# EAGLE design tbs4 (EAGLE 6.2)
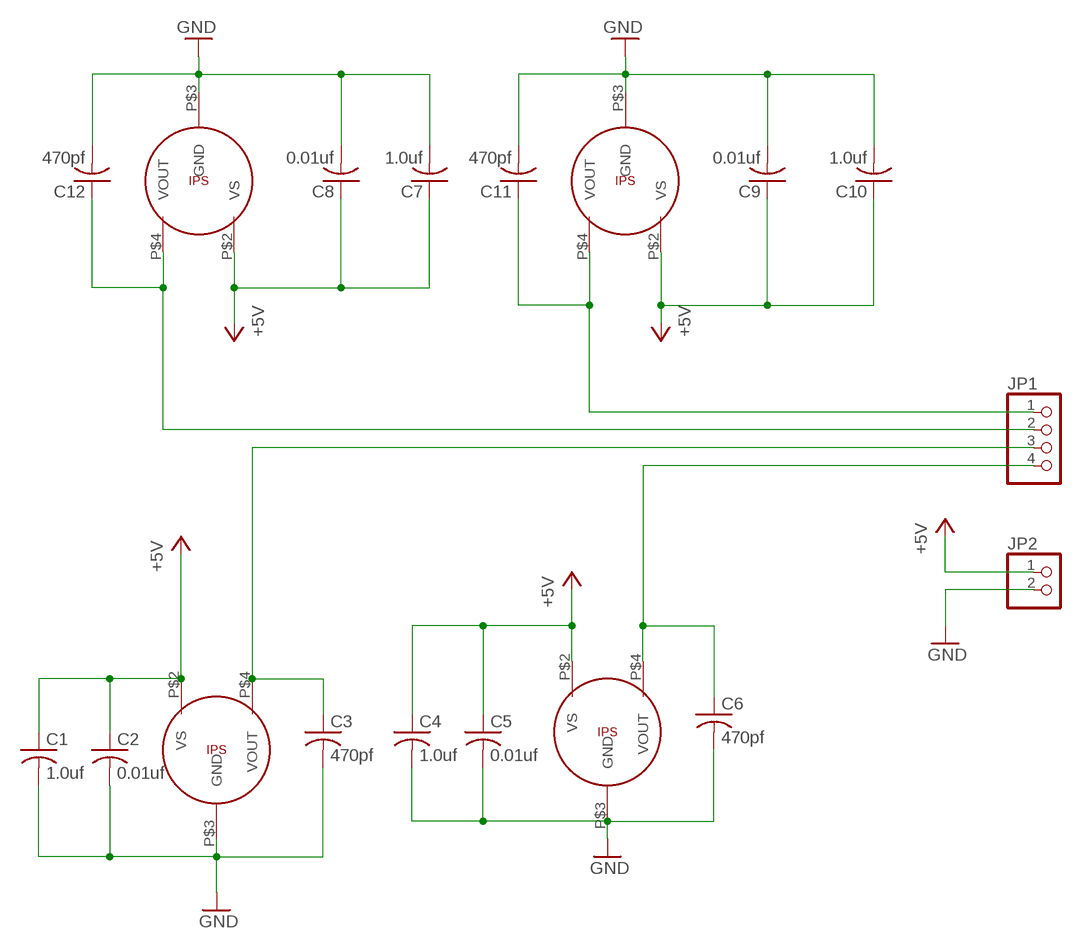
[diagram p0: schematic, sheet 1]

## Parts
C1  1.0uf  C-USC0603  [C0603]
C2  0.01uf  C-USC0603  [C0603]
C3  470pf  C-USC0603  [C0603]
C4  1.0uf  C-USC0603  [C0603]
C5  0.01uf  C-USC0603  [C0603]
C6  470pf  C-USC0603  [C0603]
C7  1.0uf  C-USC0603  [C0603]
C8  0.01uf  C-USC0603  [C0603]
C9  0.01uf  C-USC0603  [C0603]
C10  1.0uf  C-USC0603  [C0603]
C11  470pf  C-USC0603  [C0603]
C12  470pf  C-USC0603  [C0603]
IPS1  MPXV5050VC6T1  [SOP-CASE-482A]
IPS2  MPXV5050VC6T1  [SOP-CASE-482A]
IPS3  MPXV5050VC6T1  [SOP-CASE-482A]
IPS4  MPXV5050VC6T1  [SOP-CASE-482A]
JP1  PINHD-1X4  [1X04]
JP2  PINHD-1X2  [1X02]

## Nets
+5V: C1.1 C2.1 C4.1 C5.1 C7.1 C8.1 C9.1 C10.1 IPS1.P$2(VS) IPS2.P$2(VS) IPS3.P$2(VS) IPS4.P$2(VS) JP2.1
GND: C1.2 C2.2 C3.2 C4.2 C5.2 C6.2 C7.2 C8.2 C9.2 C10.2 C11.2 C12.2 IPS1.P$3(GND) IPS2.P$3(GND) IPS3.P$3(GND) IPS4.P$3(GND) JP2.2
OUTPUT1: C6.1 IPS4.P$4(VOUT) JP1.4
OUTPUT2: C3.1 IPS3.P$4(VOUT) JP1.3
OUTPUT3: C12.1 IPS2.P$4(VOUT) JP1.2
OUTPUT4: C11.1 IPS1.P$4(VOUT) JP1.1

## Library data of the parts
C1-C12 = resistor:C-US: CAPACITOR, American symbol
IPS1-IPS4 = freescaleX:MPXV5050VC6T1: MPXV5050VC6T1 Integrated Pressure Sensor
JP1 = pinhead:PINHD-1X4: PIN HEADER
JP2 = pinhead:PINHD-1X2: PIN HEADER

## Board
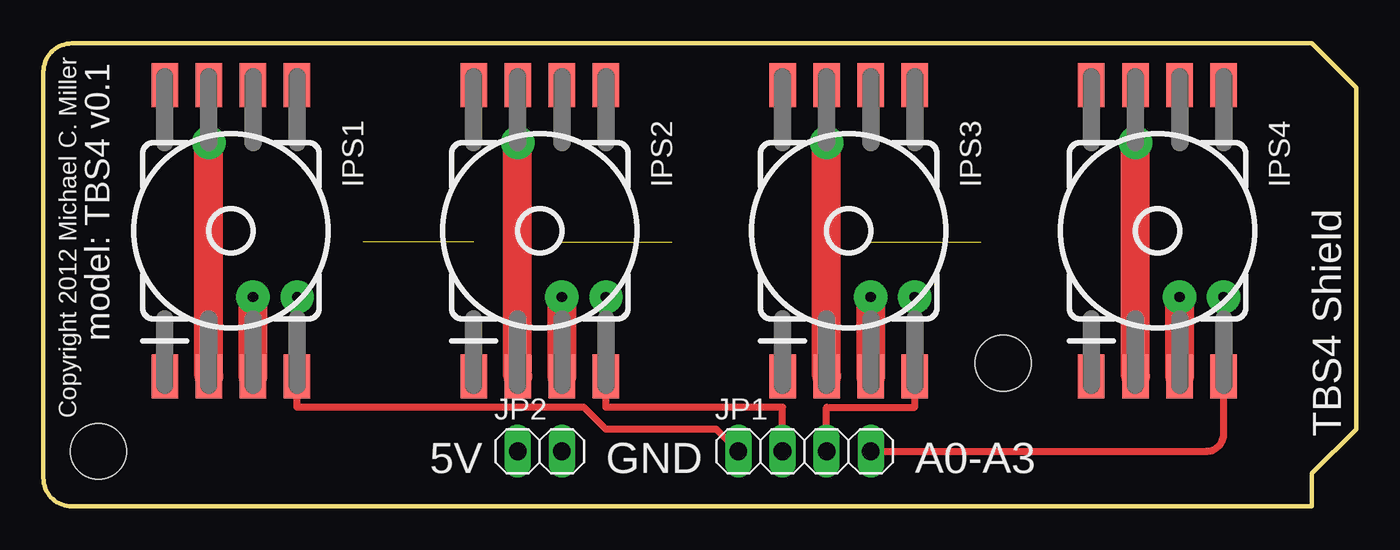
[diagram p1: board, top side]
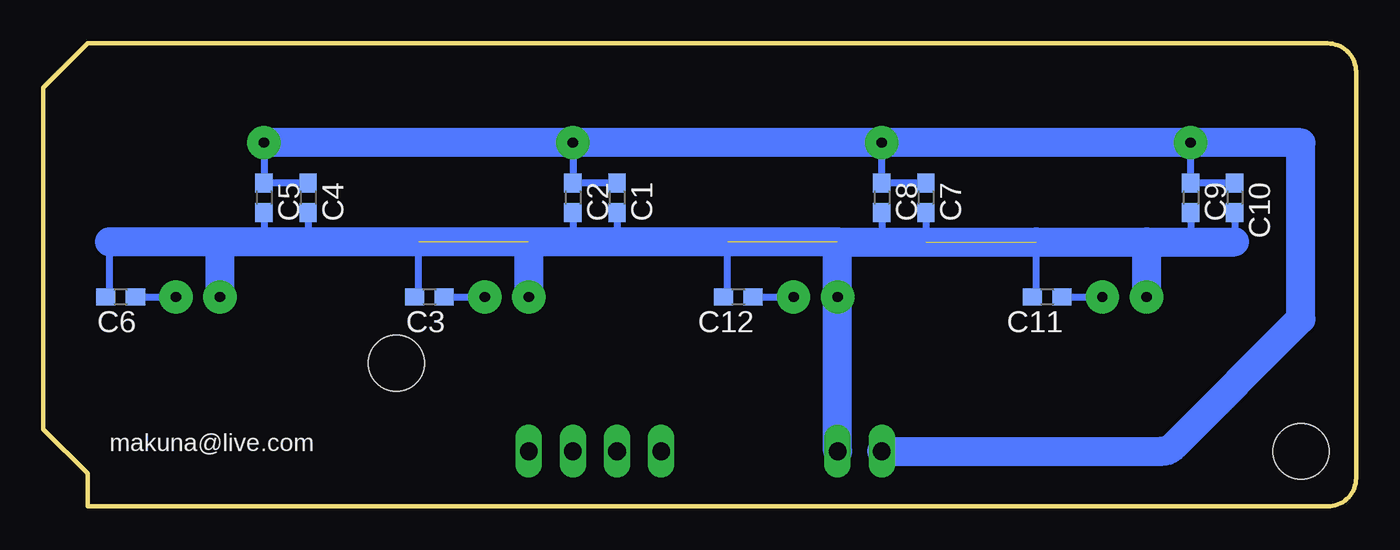
[diagram p2: board, bottom side, seen from below]

Size 75.57 x 26.67 mm. Coordinates in mm from the lower left corner, seen from the top.
Outline: 0,25.04 0,1.64 arc90 1.64,0 73.03,0 73.03,1.91 75.57,4.45 75.57,24.13 73.03,26.67 1.64,26.67 arc90 0,25.04
Copper layers (1*16): Top 0.035mm / dielectric 1.5mm / Bottom 0.035mm
Design rules: minimum track width 10mil, minimum drill 12mil, track to track 8mil, track to pad 8mil, pad to pad 8mil, via to via 8mil, smd to smd 8mil, copper to edge 40mil, drill to drill 8mil, minimum pad ring 10mil, minimum via ring 26mil, stop-mask expansion 4mil, vias tented up to drill 0mil, thermal gap 10mil
Holes 3.2 mm at 3.17,3.17 55.24,8.26

### Footprints (pad centres in the part's own frame; a part is rotated, then mirrored left to right if it is on the bottom)
C0603 = smd 1.1 x 1: 1 -0.85,0; 2 0.85,0
SOP-CASE-482A = smd 2.54 x 1.524: P$1 8.382,-3.81; P$2 8.382,-1.27; P$3 8.382,1.27; P$4 8.382,3.81; P$5 -8.382,3.81; P$6 -8.382,1.27; P$7 -8.382,-1.27; P$8 -8.382,-3.81
1X04 = drill 1.016 long: 1 -3.81,0; 2 -1.27,0; 3 1.27,0; 4 3.81,0
1X02 = drill 1.016 long: 1 -1.27,0; 2 1.27,0

### Placement (x,y rotation side)
C1  42.54,17.78 270 bottom
C2  45.09,17.78 270 bottom
C3  53.34,12.06 180 bottom
C4  60.32,17.78 270 bottom
C5  62.86,17.78 270 bottom
C6  71.12,12.06 180 bottom
C7  24.77,17.78 270 bottom
C8  27.31,17.78 270 bottom
C9  9.53,17.78 270 bottom
C10  6.98,17.78 270 bottom
C11  17.78,12.06 180 bottom
C12  35.56,12.06 180 bottom
IPS1  10.79,15.88 270 top
IPS2  28.58,15.88 270 top
IPS3  46.35,15.88 270 top
IPS4  64.14,15.88 270 top
JP1  43.81,3.17 0 top
JP2  28.58,3.17 0 top

### Tracks (layer width: path | path; a pad name or v marks a point on that pad's centre or on a via)
+5V  (via drill 0.6)
  Top 1.676: IPS1.P$2 v9.53,20.96 | IPS3.P$2 v45.09,20.96 | IPS4.P$2 v62.86,20.96 | IPS2.P$2 v27.31,20.96
  Bottom 0.406: v62.86,20.96 C5.1 C4.1 | v45.09,20.96 C2.1 C1.1 | v9.53,20.96 C9.1 C10.1 | C7.1 C8.1 v27.31,20.96
  Bottom 1.676: JP2.1 11.21,3.17 arc-45 10.5,3.47 3.17,10.79 3.17,20.96 v9.53,20.96 v27.31,20.96 v45.09,20.96 v62.86,20.96
GND  (via drill 0.6)  (3 unrouted)
  Top 1.676: IPS1.P$3 v12.06,12.06 | IPS2.P$3 v29.85,12.06 | IPS3.P$3 v47.62,12.06 | IPS4.P$3 v65.41,12.06
  Bottom 0.406: C9.2 9.53,15.24 | C8.2 27.31,15.24 | C7.2 24.77,15.24 | C1.2 42.54,15.24 | C2.2 45.09,15.24 | C4.2 60.32,15.24 | C5.2 62.86,15.24 | C10.2 6.98,15.24 | C3.2 53.98,12.06 53.98,15.24 | C6.2 71.76,12.06 71.76,15.24 | C12.2 36.2,12.06 36.2,15.24 | C11.2 18.42,12.06 18.42,15.24
  Bottom 1.676: JP2.2 v29.85,12.06 29.85,15.24 | 29.85,15.24 27.31,15.24 24.77,15.24 18.42,15.24 12.06,15.24 | 12.06,15.24 9.53,15.24 6.98,15.24 | 29.85,15.24 36.2,15.24 42.54,15.24 45.09,15.24 47.62,15.24 | 47.62,15.24 53.98,15.24 60.32,15.24 62.86,15.24 65.41,15.24 | 65.41,15.24 71.76,15.24 | 65.41,15.24 v65.41,12.06 | 47.62,15.24 v47.62,12.06 | 12.06,15.24 v12.06,12.06
OUTPUT1  (via drill 0.6)
  Top 0.406: JP1.4 66.95,3.17 arc90 67.95,4.17 IPS4.P$4 v67.95,12.06
  Bottom 0.406: C6.1 v67.95,12.06
OUTPUT2  (via drill 0.6)
  Top 0.406: JP1.3 45.09,5.71 50.16,5.71 IPS3.P$4 v50.16,12.06
  Bottom 0.406: C3.1 v50.16,12.06
OUTPUT3  (via drill 0.6)
  Top 0.406: JP1.2 42.54,5.71 32.38,5.71 IPS2.P$4 v32.38,12.06
  Bottom 0.406: C12.1 v32.38,12.06
OUTPUT4  (via drill 0.6)
  Top 0.406: JP1.1 38.73,4.45 32.38,4.45 31.12,5.71 14.61,5.71 IPS1.P$4 v14.61,12.06
  Bottom 0.406: C11.1 v14.61,12.06

### Text on the board
tNames: TBS4 Shield | model: TBS4 v0.1 | Copyright 2012 Michael C. Miller | 5V | GND | A0-A3
bNames: makuna@live.com